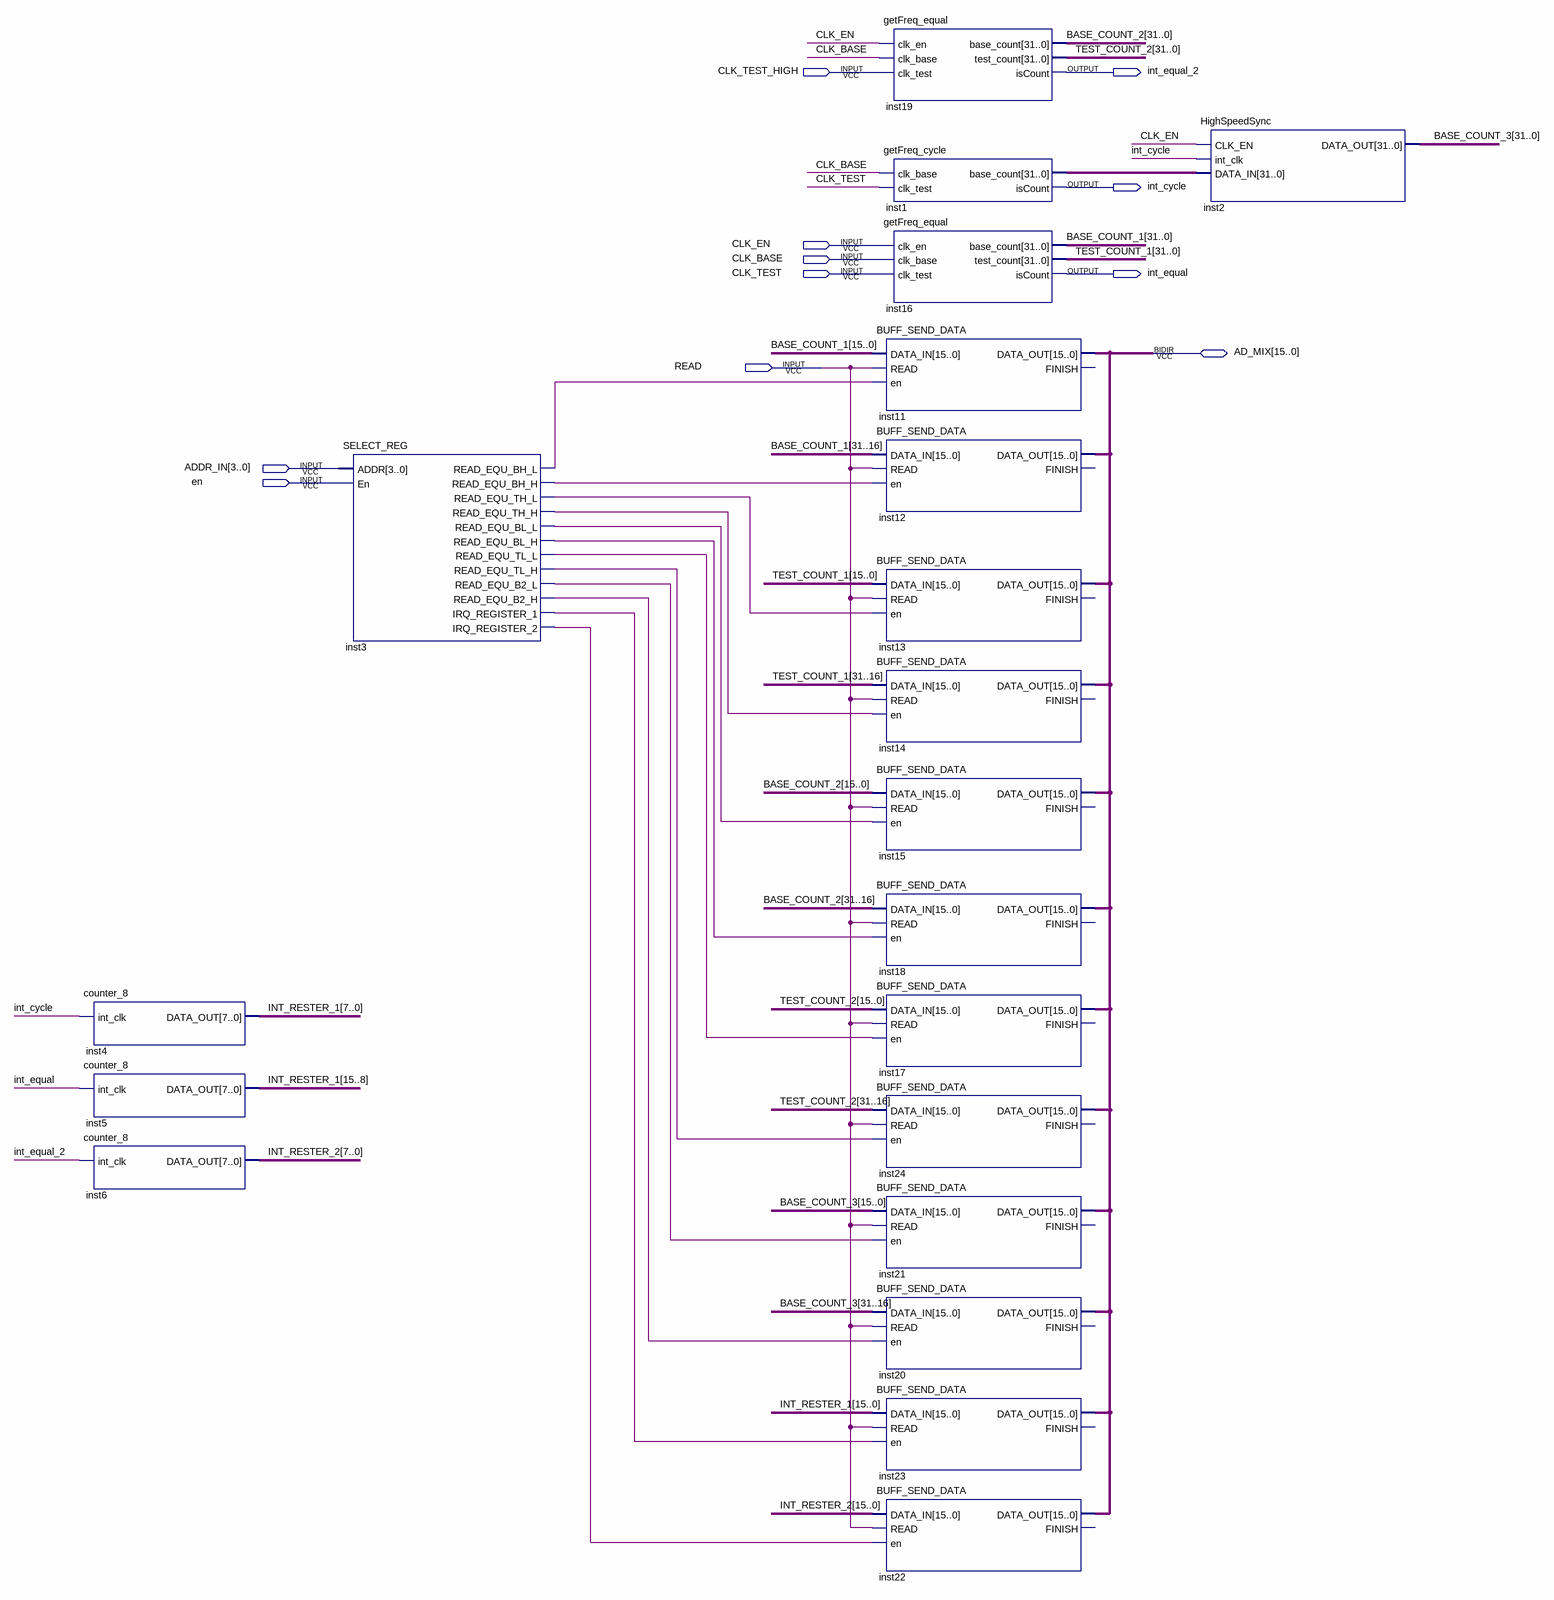
[diagram p0: schematic sheet]
// Quartus schematic FREQs.bdf as structural Verilog: 20 symbols, 11 pins
module FREQs (
  input  CLK_TEST_HIGH,
  input  CLK_EN,
  input  CLK_BASE,
  input  CLK_TEST,
  input  READ,
  input  [3:0] ADDR_IN,
  input  en,
  inout  [15:0] AD_MIX,
  output int_equal_2,
  output int_cycle,
  output int_equal
);

  wire inst3_irq_register_1, inst3_irq_register_2, inst3_read_equ_b2_h, inst3_read_equ_b2_l,
       inst3_read_equ_bh_h, inst3_read_equ_bh_l, inst3_read_equ_bl_h, inst3_read_equ_bl_l,
       inst3_read_equ_th_h, inst3_read_equ_th_l, inst3_read_equ_tl_h, inst3_read_equ_tl_l;
  wire [15:0] INT_RESTER_1, INT_RESTER_2;
  wire [31:0] BASE_COUNT_1, BASE_COUNT_2, BASE_COUNT_3, inst1_base_count, TEST_COUNT_1, TEST_COUNT_2;

  counter_8 inst4 (.int_clk(int_cycle), .DATA_OUT(INT_RESTER_1[7:0]));
  counter_8 inst5 (.int_clk(int_equal), .DATA_OUT(INT_RESTER_1[15:8]));
  counter_8 inst6 (.int_clk(int_equal_2), .DATA_OUT(INT_RESTER_2[7:0]));
  SELECT_REG inst3 (
    .ADDR(ADDR_IN), .En(en), .READ_EQU_BH_L(inst3_read_equ_bh_l), .READ_EQU_BH_H(inst3_read_equ_bh_h),
    .READ_EQU_TH_L(inst3_read_equ_th_l), .READ_EQU_TH_H(inst3_read_equ_th_h),
    .READ_EQU_BL_L(inst3_read_equ_bl_l), .READ_EQU_BL_H(inst3_read_equ_bl_h),
    .READ_EQU_TL_L(inst3_read_equ_tl_l), .READ_EQU_TL_H(inst3_read_equ_tl_h),
    .READ_EQU_B2_L(inst3_read_equ_b2_l), .READ_EQU_B2_H(inst3_read_equ_b2_h),
    .IRQ_REGISTER_1(inst3_irq_register_1), .IRQ_REGISTER_2(inst3_irq_register_2));
  BUFF_SEND_DATA inst11 (
    .DATA_IN(BASE_COUNT_1[15:0]), .READ(READ), .en(inst3_read_equ_bh_l), .DATA_OUT(AD_MIX));  // open: FINISH
  BUFF_SEND_DATA inst12 (
    .DATA_IN(BASE_COUNT_1[31:16]), .READ(READ), .en(inst3_read_equ_bh_h), .DATA_OUT(AD_MIX));  // open: FINISH
  BUFF_SEND_DATA inst13 (
    .DATA_IN(TEST_COUNT_1[15:0]), .READ(READ), .en(inst3_read_equ_th_l), .DATA_OUT(AD_MIX));  // open: FINISH
  BUFF_SEND_DATA inst14 (
    .DATA_IN(TEST_COUNT_1[31:16]), .READ(READ), .en(inst3_read_equ_th_h), .DATA_OUT(AD_MIX));  // open: FINISH
  BUFF_SEND_DATA inst15 (
    .DATA_IN(BASE_COUNT_2[15:0]), .READ(READ), .en(inst3_read_equ_bl_l), .DATA_OUT(AD_MIX));  // open: FINISH
  BUFF_SEND_DATA inst18 (
    .DATA_IN(BASE_COUNT_2[31:16]), .READ(READ), .en(inst3_read_equ_bl_h), .DATA_OUT(AD_MIX));  // open: FINISH
  BUFF_SEND_DATA inst17 (
    .DATA_IN(TEST_COUNT_2[15:0]), .READ(READ), .en(inst3_read_equ_tl_l), .DATA_OUT(AD_MIX));  // open: FINISH
  BUFF_SEND_DATA inst24 (
    .DATA_IN(TEST_COUNT_2[31:16]), .READ(READ), .en(inst3_read_equ_tl_h), .DATA_OUT(AD_MIX));  // open: FINISH
  BUFF_SEND_DATA inst21 (
    .DATA_IN(BASE_COUNT_3[15:0]), .READ(READ), .en(inst3_read_equ_b2_l), .DATA_OUT(AD_MIX));  // open: FINISH
  BUFF_SEND_DATA inst20 (
    .DATA_IN(BASE_COUNT_3[31:16]), .READ(READ), .en(inst3_read_equ_b2_h), .DATA_OUT(AD_MIX));  // open: FINISH
  BUFF_SEND_DATA inst23 (
    .DATA_IN(INT_RESTER_1), .READ(READ), .en(inst3_irq_register_1), .DATA_OUT(AD_MIX));  // open: FINISH
  BUFF_SEND_DATA inst22 (
    .DATA_IN(INT_RESTER_2), .READ(READ), .en(inst3_irq_register_2), .DATA_OUT(AD_MIX));  // open: FINISH
  getFreq_equal inst19 (
    .clk_en(CLK_EN), .clk_base(CLK_BASE), .clk_test(CLK_TEST_HIGH), .base_count(BASE_COUNT_2),
    .test_count(TEST_COUNT_2), .isCount(int_equal_2));
  getFreq_cycle inst1 (.clk_base(CLK_BASE), .clk_test(CLK_TEST), .base_count(inst1_base_count), .isCount(int_cycle));
  getFreq_equal inst16 (
    .clk_en(CLK_EN), .clk_base(CLK_BASE), .clk_test(CLK_TEST), .base_count(BASE_COUNT_1),
    .test_count(TEST_COUNT_1), .isCount(int_equal));
  HighSpeedSync inst2 (.CLK_EN(CLK_EN), .int_clk(int_cycle), .DATA_IN(inst1_base_count), .DATA_OUT(BASE_COUNT_3));
endmodule
